# Altium schematic sheet AMU-S13-V00-BSPDShutdownRelay.SchDoc: Shutdown Relay
size A3; DrawnBy: Jonn Dillon; DocumentNumber: 9; Revision: 01; SheetNumber: 13; SheetTotal: 31
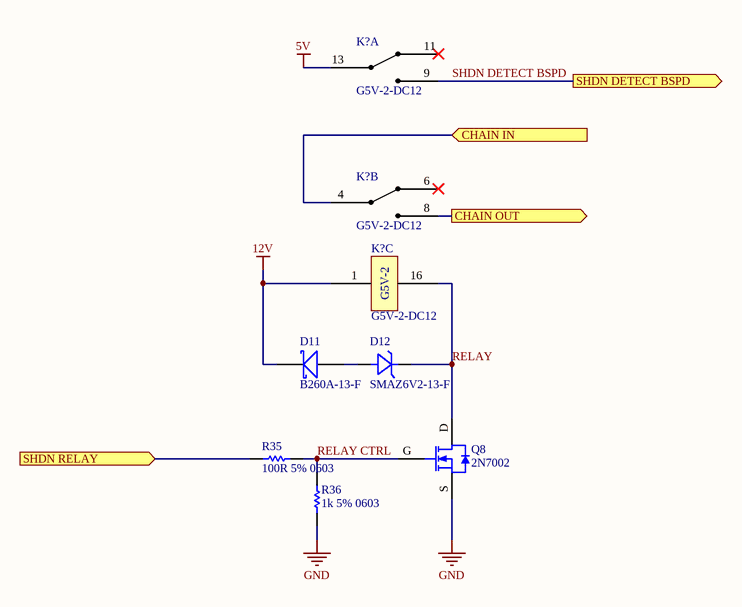
[diagram p0: AMU-S13-V00-BSPDShutdownRelay.SchDoc]

## Parts
(Parts that share a designator on the sheet are numbered #1, #2 ... from top to bottom, then left to right.)
D11  B260A-13-F  [SMA]
D12  SMAZ6V2-13-F  [SMA]
K?#1  G5V-2-DC12  [G5V-2]  (part A of 3)
K?#2  G5V-2-DC12  [G5V-2]  (part B of 3)
K?#3  G5V-2-DC12  [G5V-2]  (part C of 3)
Q8  2N7002  [SOT23-3]
R35  100R 5% 0603  [Res_ThinFilm_0603]
R36  1k 5% 0603  [Res_ThinFilm_0603]

## Ports
CHAIN IN (in), CHAIN OUT (out), SHDN DETECT BSPD (out), SHDN RELAY (in)

## Nets
5V: K?#1.13
12V: D11.K K?#3.1
GND: Q8.S R36.1
CHAIN IN: K?#2.4 ; port CHAIN IN
CHAIN OUT: K?#2.8 ; port CHAIN OUT
RELAY: D12.K(Cathode) K?#3.16 Q8.D
RELAY CTRL: Q8.G R35.2 R36.2
SHDN DETECT BSPD: K?#1.9 ; port SHDN DETECT BSPD
SHDN RELAY: R35.1 ; port SHDN RELAY
NetD11_A: D11.A D12.A(Anode)

Not connected (* = marked no-connect by the designer): K?#1 11*; K?#2 6*

## Notes on the sheet
- Revision History:
- Sheet Title:
- Rev
- Date
- Description
- Project:
- Size:
- Drawn By:
- A3
- Number:
- Revision:
- Sheet
- Version:
- of
- QUT Motorsport
- O-120, Gardens Point
- 2 George Street
- Brisbane, QLD 4000
- Australia
- Print Date:
- Print Time:
- File Name:
- (in symbol G5V-2-DC12, part C) G5V-2

## Library data of the parts
D11 = B260A-13-F: Diode, Schottky Barrier Rectifier, 60 V, 2 A, B260A-13-F
D12 = SMAZ6V2-13-F: Zener Diode 6.2V 1W ±5% Surface Mount SMA; Manufacturer: Generic; MPN: 5V6 500mW SMA
K?#1-K?#3 = G5V-2-DC12: General Purpose Relay DPDT (2 Form C) Through Hole, 12V, 2A
R35 = 100R 5%, 0603: Resistor, SMD, 100R, 0.1W, 5%, 0603
R36 = 1k 5% 0603: Resistor, SMD, 1k, 0.1W, 5%, 0603